# Altium schematic sheet Schematic_2023-01-06.schdoc
size 229 x 100 mm
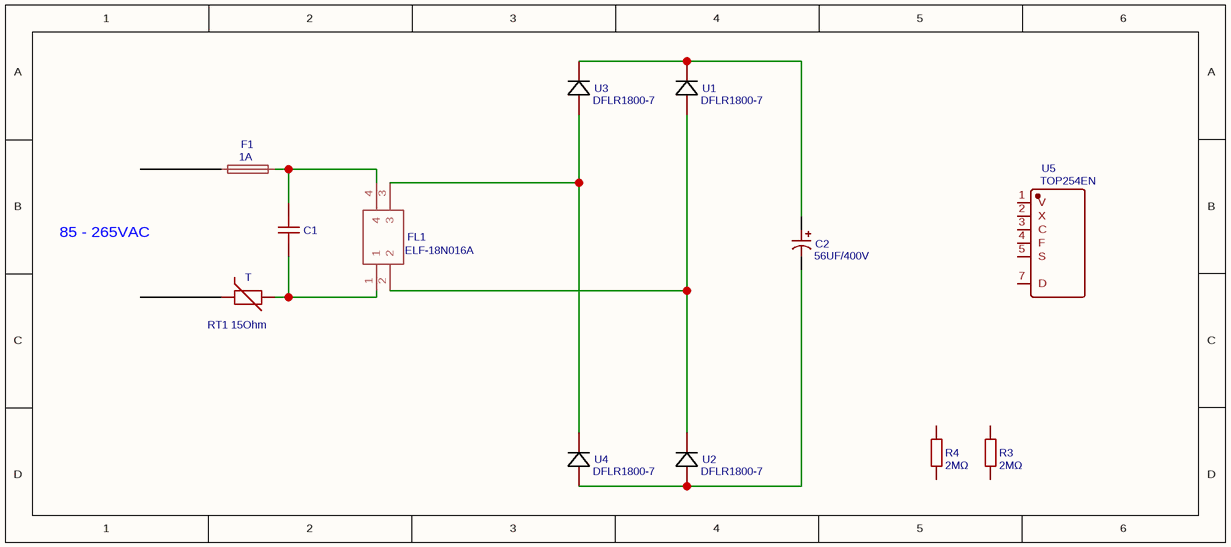
[diagram p0: Schematic_2023-01-06.schdoc]

## Parts
C1  C212G473K3AC000  [CAP-TH_L9.8-W5.0-P7.50-D1.0]  (value not drawn)
C2  56UF/400V  [CAP-TH_BD12.8-P5.00-D0.6-FD]
F1  1A  [FUSE-HOLDER-WITH-COVER-FOR-5X20MM-FUSE_FOOTPRINT]
FL1  ELF-18N016A  [ELF18N016A]
R3  2MΩ  [CAP-TH_L15.1-W5.0-P12.70-D1.2]
R4  2MΩ  [CAP-TH_L15.1-W5.0-P12.70-D1.2]
T  RT1 15Ohm  [TERMISTOR]
U1  DFLR1800-7  [DFLR1800-7]
U2  DFLR1800-7  [DFLR1800-7]
U3  DFLR1800-7  [DFLR1800-7]
U4  DFLR1800-7  [DFLR1800-7]
U5  TOP254EN  [ESIP-7C__L10.2-W2.0-P2.54-LS3.0-TL]

## Nets
NetC1_1: C1.1 FL1.1 T.1
NetC1_2: C1.2 F1.2 FL1.4
NetC2_1: C2.1 U1.2 U3.2
NetC2_2: C2.2 U2.1 U4.1
NetFL1_2: FL1.2 U1.1 U2.2
NetFL1_3: FL1.3 U3.1 U4.2

Not connected (* = marked no-connect by the designer): F1 1; R3 1 2; R4 1 2; T 2; U5 1(V) 2(X) 3(C) 4(F) 5(S) 7(D)

## Notes on the sheet
- 85 - 265VAC

## Library data of the parts
C1 = C212G473K3AC000: BOM_Manufacturer: faratronic(厦门法拉); Contributor: lcsc; Capacitance: 47nF; BOM_Supplier: LCSC; BOM_Supplier Part: C3025105; BOM_Manufacturer Part: C212G473K3AC000; link: https://atta.szlcsc.com/upload/public/pdf/source/20210701/C2840807_F527A4AE17BBF4EE9067F9ABB44EC845.pdf; spicePre: U; spiceSymbolName: C212G473K3AC000
C2 = 56UF/400V: BOM_Manufacturer: null; BOM_Manufacturer Part: 47uF/400V; Contributor: lcsc; BOM_Supplier: LCSC; BOM_Supplier Part: C9900023263; BOM_JLCPCB Part Class: Extended Part; spicePre: C; spiceSymbolName: 47UF/400V
F1 = 1A: Contributor: icet-t1; spicePre: F; spiceSymbolName: FUSE HOLDER PANJANG
FL1 = ELF-18N016A: Contributor: Praudyogi_EE; spicePre: F; spiceSymbolName: ELF-18N016A
R3 R4 = 2MΩ: BOM_Manufacturer: muRata(村田); BOM_Manufacturer Part: MHR0314SA207F70; Resistance (Ohms): 200M; Contributor: LCSC; nameAlias: Resistance; BOM_Supplier: LCSC; BOM_Supplier Part: C116786; BOM_JLCPCB Part Class: Extended Part; spicePre: R; spiceSymbolName: MHR0314SA207F70
T = RT1 15Ohm: Contributor: dentflexbrasil; spicePre: T; spiceSymbolName: TERMISTOR
U1-U4 = DFLR1800-7: BOM_Manufacturer: Diodes Incorporated; Contributor: nscw2011; link: https://kr.mouser.com/datasheet/2/115/DFLR1800-10520.pdf; spicePre: U; spiceSymbolName: DFLR1800-7
U5 = TOP254EN: BOM_Manufacturer: Power Integrations(帕沃英蒂格盛); Contributor: lcsc; BOM_Supplier: LCSC; BOM_Supplier Part: C568146; BOM_Manufacturer Part: TOP254EN; link: https://atta.szlcsc.comnull; spicePre: U; spiceSymbolName: TOP254EN